# Altium schematic sheet Modulo de isolação AC.SchDoc
size A4; Author: Nelson Seixas; SheetNumber: 1; SheetTotal: 3
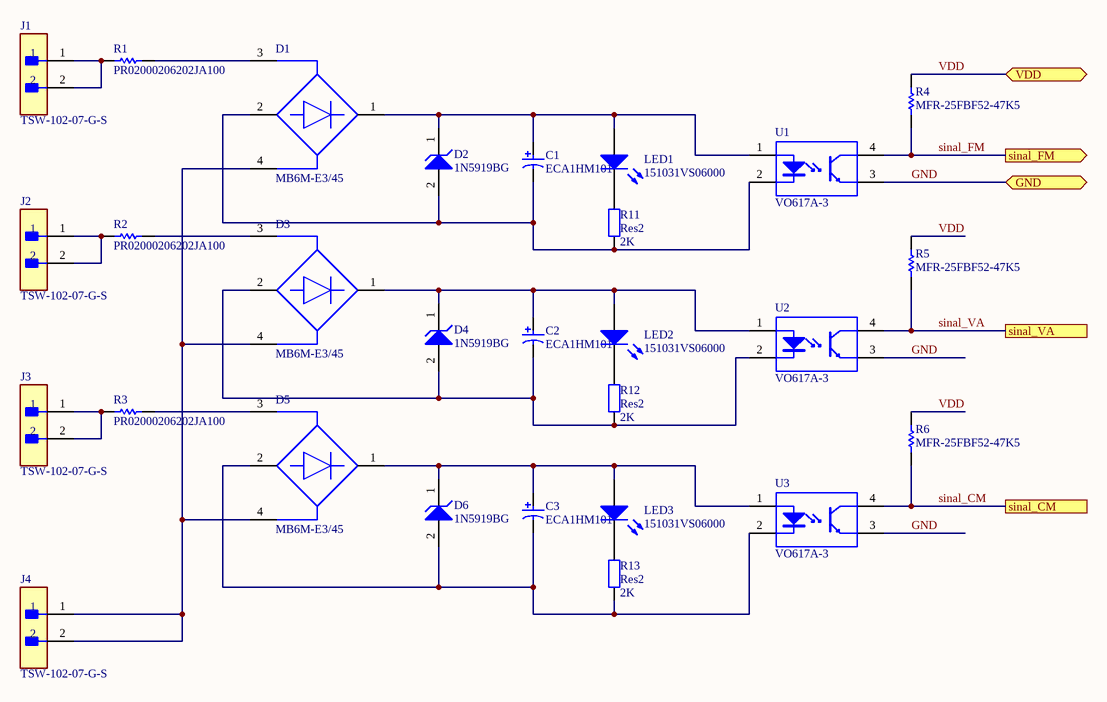
[diagram p0: Modulo de isolação AC.SchDoc]

## Parts
C1  ECA1HM101  [CAPPR65-350-1150X800X1250]
C2  ECA1HM101  [CAPPR65-350-1150X800X1250]
C3  ECA1HM101  [CAPPR65-350-1150X800X1250]
D1  MB6M-E3/45  [FP-MB6M-E3-45-MFG]
D2  1N5919BG  [ONSC-AXIAL_LEAD-2-59-10_P]
D3  MB6M-E3/45  [FP-MB6M-E3-45-MFG]
D4  1N5919BG  [ONSC-AXIAL_LEAD-2-59-10_P]
D5  MB6M-E3/45  [FP-MB6M-E3-45-MFG]
D6  1N5919BG  [ONSC-AXIAL_LEAD-2-59-10_P]
J1  TSW-102-07-G-S  [FP-TSW-102-07-G-S-MFG]
J2  TSW-102-07-G-S  [FP-TSW-102-07-G-S-MFG]
J3  TSW-102-07-G-S  [FP-TSW-102-07-G-S-MFG]
J4  TSW-102-07-G-S  [FP-TSW-102-07-G-S-MFG]
LED1  151031VS06000  [Type 3mm]
LED2  151031VS06000  [Type 3mm]
LED3  151031VS06000  [Type 3mm]
R1  PR02000206202JA100  [VISH-A1-2_V2]
R2  PR02000206202JA100  [VISH-A1-2_V2]
R3  PR02000206202JA100  [VISH-A1-2_V2]
R4  MFR-25FBF52-47K5  [RESA60-630X240]
R5  MFR-25FBF52-47K5  [RESA60-630X240]
R6  MFR-25FBF52-47K5  [RESA60-630X240]
R11  Res2  value 2K  [AXIAL-0.4]
R12  Res2  value 2K  [AXIAL-0.4]
R13  Res2  value 2K  [AXIAL-0.4]
U1  VO617A-3  [VISH-DIP-4]
U2  VO617A-3  [VISH-DIP-4]
U3  VO617A-3  [VISH-DIP-4]

## Ports
GND (bidir), sinal_CM, sinal_FM (out), sinal_VA, VDD (bidir)

## Nets
GND: U1.3(EMITTER) U2.3(EMITTER) U3.3(EMITTER) ; port GND
sinal_CM: R6.1 U3.4(COLLECTOR) ; port sinal_CM
sinal_FM: R4.1 U1.4(COLLECTOR) ; port sinal_FM
sinal_VA: R5.1 U2.4(COLLECTOR) ; port sinal_VA
VDD: R4.2 R5.2 R6.2 ; port VDD
NetC1_1: C1.1 D1.1(+) D2.1(K) LED1.2(A) U1.1(ANODE)
NetC1_2: C1.2 D1.2(-) D2.2(A) R11.1 U1.2(CATHODE)
NetC2_1: C2.1 D3.1(+) D4.1(K) LED2.2(A) U2.1(ANODE)
NetC2_2: C2.2 D3.2(-) D4.2(A) R12.1 U2.2(CATHODE)
NetC3_1: C3.1 D5.1(+) D6.1(K) LED3.2(A) U3.1(ANODE)
NetC3_2: C3.2 D5.2(-) D6.2(A) R13.1 U3.2(CATHODE)
NetD1_3: D1.3(1_~) R1.2
NetD1_4: D1.4(2_~) D3.4(2_~) D5.4(2_~) J4.1 J4.2
NetD3_3: D3.3(1_~) R2.2
NetD5_3: D5.3(1_~) R3.2
NetJ1_1: J1.1 J1.2 R1.1
NetJ2_1: J2.1 J2.2 R2.1
NetJ3_1: J3.1 J3.2 R3.1
NetLED1_1: LED1.1(K) R11.2
NetLED2_1: LED2.1(K) R12.2
NetLED3_1: LED3.1(K) R13.2

## Library data of the parts
C1-C3 = CMP-1665-00042-2: Aluminum Electrolytic Capacitor, 100 uF, +/- 20%, 50 V, -40 to 85 degC, 2-Pin THD, RoHS, Bulk; Manufacturer: Panasonic; Lead Diameter: 0.6mm; Dielectric Material: Aluminium; Voltage Rating (DC): 50V; Ripple Current (AC): 250mA; Polarity: Polar; Leakage Current: 3uA; Capacitance: 100uF; Life (Hours): 2000Hour; Lead/Base Style: Straight; Dissipation Factor: 0.12%; Radiation Hardening: No; Height: 11.5mm; Package Quantity: 200; Package Reference: CAPPR65-350-1150X800X1250; Min Operating Temperature: -40degC; Mount: ThroughHole; Package Description: 2-Pin Radial Lead, Dia 8 mm, Height 12.5 mm; Case/Package: Radial; Diameter: 8mm; Voltage Rating: 50V; Length: 11.5mm; REACH SVHC: NoSVHC; Height - Seated (Max): 0.492inch; Datasheet URL: https://industrial.panasonic.com/cdbs/www-data/pdf/RDF0000/ABA0000C1218.pdf; RoHSCompliant: true; Ripple Current: 250mA; Lead Free: LeadFree; Voltage: 50V; Manufacturer URL: http://www.panasonic.com/; Number of Pins: 2; Datasheet Version: Rev. 05, 10/2016; Packaging: Bulk; Termination: Radial; Max Operating Temperature: 85degC; Tolerance: 20%; Lead Pitch: 3.5mm
D1 D3 D5 = CMP-02540-000050-1: BRIDGE RECT 1P 600V 500MA MBM; Max Reverse Leakage Current: 5uA; Forward Current: 800mA; Element Configuration: Single; Forward Voltage: 1V; Peak Non-Repetitive Surge Current: 35A; Number of Elements: 1; Reverse Recovery Time: 150ns; Radiation Hardening: No; Package Quantity: 100; Height: 2.7mm; Max Repetitive Reverse Voltage (Vrrm): 600V; Packaging: Rail/Tube; Mount: Surface Mount; Peak Reverse Current: 5uA; Max Surge Current: 35A; Width: 4.1mm; Min Operating Temperature: -55°C; Case/Package: DIP; Length: 4.83mm; Max Operating Temperature: 150°C; Number of Pins: 4
D2 D4 D6 = CMP-1060-00030-1: 3 W Zener Voltage Regulator, 2-Pin Axial_Lead, Pb-Free, Bulk Box; Manufacturer: On Semiconductor; VZ Typ (V): 5.6; ComponentLink2URL: http://www.onsemi.cn/pub_link/Collateral/1N5913B-D.PDF; PackageDescription: 2-Pin, Axial Lead, Diameter 2.35 mm; Packing: Bulk Box; ComponentLink2Description: Datasheet; ComponentLink3URL: http://www.onsemi.cn/pub_link/Collateral/59-10.PDF; ComponentLink1URL: http://www.onsemi.com/; PartNumber: 1N5919BG; PackageVersion: Rev. U, 02/2005; RoHS: Pb-Free; ComponentLink3Description: Package Specification; DatasheetVersion: Rev. 5; ComponentLink1Description: Manufacturer URL; PackageReference: AXIAL_LEAD-2-59-10; Mounting Technology: Through Hole
J1-J4 = CMP-02766-000084-1: CONN HEADER VERT 2POS 2.54MM; Manufacturer: Samtec; Number Of Contacts: 2; Voltage Rating: 550V; Conn Orientation: Straight; Current Rating: 6.3A; Conn Gender: Male; Package: TSW-102-07-G-S; Digikey Description: CONN HEADER VERT 2POS 2.54MM; ComponentLink2URL: http://suddendocs.samtec.com/catalog_english/tsw_th.pdf; Height: 8.71mm; Temperature: -55°C to +125°C; Device Class L2: Headers and Wire Housings; ComponentLink2Description: Datasheet; Device Class L3: unset; Contact Material: Gold,Nickel; Temperature Range Low: -55°C; Temperature Range High: +125°C; RoHS: TRUE; Device Class L1: Connectors; Mouser Description: Conn Unshrouded Header HDR 2 POS 2.54mm Solder ST Thru-Hole Automotive Bulk; Number Of Rows: 1; Category: Conn; Pitch: 2.54mm; Lead Free: Yes; Automotive: No; Manufacturer Part Number: TSW-102-07-G-S; Footprint Url: http://suddendocs.samtec.com/prints/tsw-xxx-xx-x-x-xx-xxx-footprint.pdf; Octopart: https://octopart.com/tsw-102-07-g-s-samtec-272197
LED1-LED3 = CMP-1488-00004-1: THT LED round mono-color color lens, WL-TMRC , Bright Green; Manufacturer: Wuerth Elektronik; ComponentLink2Description: Datasheet; ComponentLink1URL: http://www.we-online.com; PartNumber: 151031VS06000; ComponentLink2URL: http://katalog.we-online.de/pbs/datasheet/7448042001.pdfhttp://katalog.we-online.de/pbs/datasheet/7448042001.pdfhttp://katalog.we-online.de/pbs/datasheet/7448042001.pdfhttp://katalog.we-online.de/pbs/datasheet/151031VS06000.pdf; ComponentLink1Description: Manufacturer URL; Emitting color: Bright Green; PackageReference: Type 3mm
R1-R3 = CMP-1240-00001-1: Power Metal Film Leaded Resistor, 62 KOhm +/-5%, 2 W, 2-Pin THD, RoHS, Ammo Pack; Manufacturer: Vishay Semiconductor; Resistance: 62 KOhm; Temperature Coefficient: +/-250 ppm/degC; Power: 2 W; ComponentLink2URL: http://www.vishay.com/docs/28729/28729.pdf; Mounting Technology: Through Hole; Tolerance: +/-5%; ComponentLink3Description: Package Specification; ComponentLink3URL: http://www.vishay.com/docs/28729/28729.pdf; ComponentLink1Description: Manufacturer URL; PartNumber: PR02000206202JA100; ComponentLink2Description: Datasheet; DatasheetVersion: Jun-13; PackageDescription: 2-Pin Axial Lead, Body 10 x 3.9 mm; ComponentLink1URL: http://www.vishay.com/; Packing: Ammo Pack; RoHS: TRUE
R4-R6 = CMP-1659-00063-1: Axial Resistor, 47.5 KOhm, +/- 1%, 0.25 W, -55 to 155 degC, 2-Pin THD, RoHS, Bulk; Tolerance: 20%; Shielding: Shielded; Current Rating: 1.3 A; Case\Package: 1008; ComponentLink1Description: Manufacturer URL; Packaging: Tape and Reel; ComponentLink2Description: Datasheet; Radiation Hardening: No; ComponentLink2URL: http://www.yageo.com/documents/recent/Yageo%20LR_MFR_2013.pdf; Min Operating Temperature: -55 degC; Mount: Surface Mount; Width: 2 mm; Length: 2.5 mm; Max Operating Temperature: 125 degC; PackageReference: MFR-25; Height: 1.2 mm; ComponentLink1URL: http://www.yageo.com/; DatasheetVersion: Apr-13; RoHSCompliant: true; Package Quantity: 3000; Case Code (Metric): 2520; PackageDescription: 2-Pin Axial Lead, Dia 2.4 mm, Body Length 6.3 mm
R11-R13 = Res2: Resistor; Published: 8-Jun-2000; LatestRevisionDate: 17-Jul-2002; LatestRevisionNote: Re-released for DXP Platform.; PackageReference: AXIAL-0.4; Publisher: Altium Limited; PackageDescription: Axial Device, Thru-Hole; 2 Leads; 0.4 in Pin Spacing
U1-U3 = CMP-2000-07400-1: Optocoupler, Phototransistor Output, High Reliability, 5300 VRMS, -55 to 110 degC, 4-Pin DIP, RoHS, Tape and Reel; Manufacturer: Vishay/Semiconductor; Maximum Current Transfer Ratio @ Current: 200%; Maximum Input Current: 60mA; Maximum Collector Current: 50mA; Maximum Collector Emitter Voltage: 80V; Output Type: DC; Typical Forward Voltage: 1.35V; Rad Hard: No; Maximum Reverse Voltage: 6V; Minimum Forward Voltage: 1V; Maximum Forward Voltage: 1.65V; Number of Channels per Chip: 1; Minimum Isolation Voltage: 5000Vrms; Maximum Collector Emitter Saturation Voltage: 400mV; Maximum Power Dissipation: 150mW; Mounting Technology: ThroughHole; Packaging: Tape&Reel; Package Reference: DIP-4; Datasheet URL: http://www.vishay.com/docs/83430/vo617a.pdf; Package: 4PDIP; Input Type: DC; Package Description: 4-Pin Double In-line Package, Body 4.58 x 6.5 mm, Pitch 2.54 mm; Manufacturer URL: http://www.vishay.com/; Operating Temperature: -55to110°C; Category: TransistorandPhotovoltaicOutputPhotoCouplers; Datasheet Version: Rev. 2.5, 08/2015